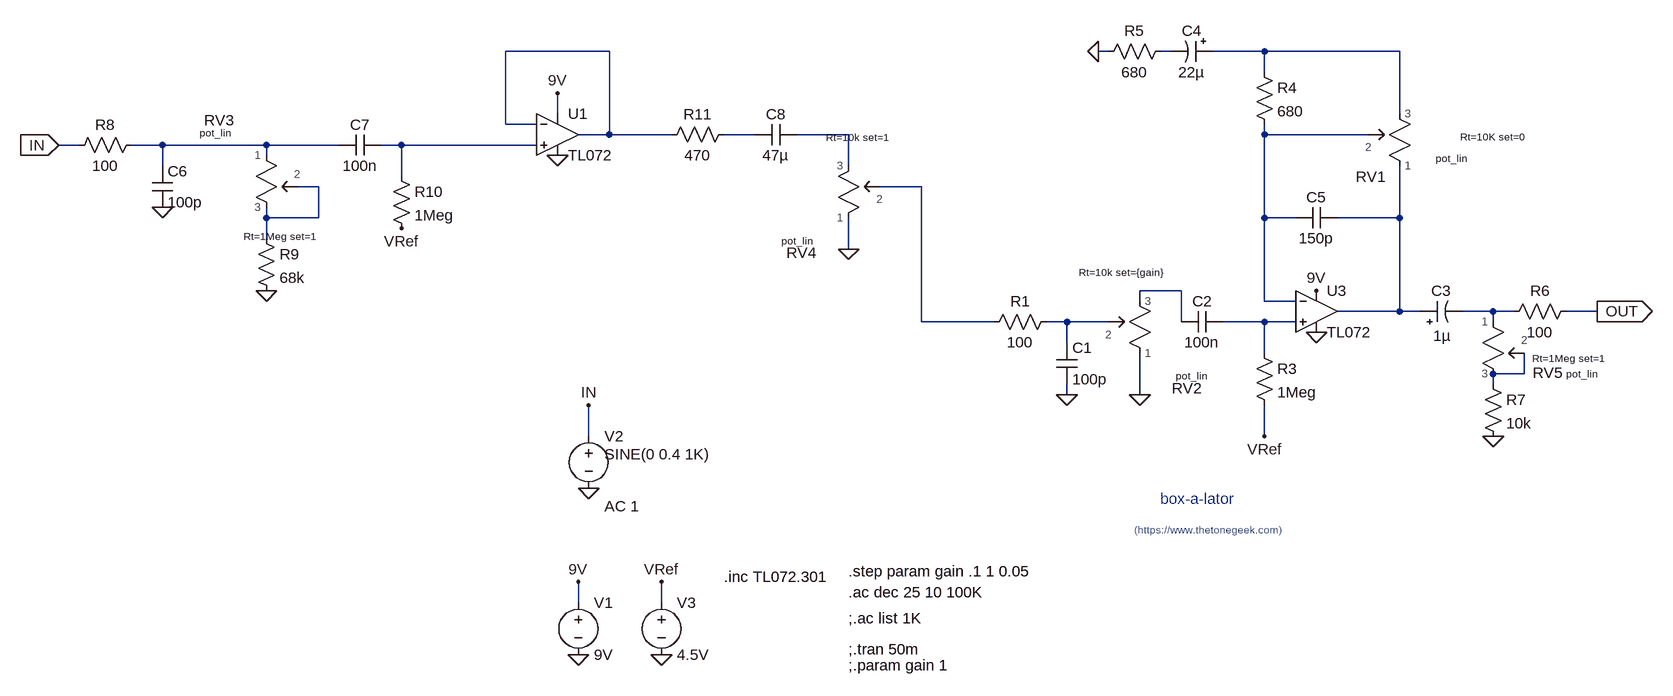
[diagram p0: schematic box-a-lator.asc]
box-a-lator.asc, the LTspice schematic file:
Version 4
SHEET 1 2004 1372
WIRE -1664 48 -1824 48
WIRE -896 48 -912 48
WIRE -800 48 -816 48
WIRE -656 48 -736 48
WIRE -448 48 -656 48
WIRE -656 80 -656 48
WIRE -1744 144 -1744 112
WIRE -448 144 -448 48
WIRE -1824 160 -1824 48
WIRE -1776 160 -1824 160
WIRE -1664 176 -1664 48
WIRE -1664 176 -1712 176
WIRE -1568 176 -1664 176
WIRE -1440 176 -1488 176
WIRE -1296 176 -1376 176
WIRE -656 176 -656 160
WIRE -496 176 -656 176
WIRE -2480 192 -2512 192
WIRE -2352 192 -2400 192
WIRE -2192 192 -2352 192
WIRE -2080 192 -2192 192
WIRE -1984 192 -2016 192
WIRE -1776 192 -1984 192
WIRE -2192 208 -2192 192
WIRE -2352 224 -2352 192
WIRE -1296 224 -1296 176
WIRE -1984 240 -1984 192
WIRE -2112 256 -2144 256
WIRE -1184 256 -1248 256
WIRE -2192 304 -2192 288
WIRE -2112 304 -2112 256
WIRE -2112 304 -2192 304
WIRE -656 304 -656 176
WIRE -608 304 -656 304
WIRE -448 304 -448 224
WIRE -448 304 -544 304
WIRE -2192 336 -2192 304
WIRE -1296 352 -1296 304
WIRE -784 416 -848 416
WIRE -848 432 -848 416
WIRE -656 432 -656 304
WIRE -608 432 -656 432
WIRE -448 448 -448 304
WIRE -448 448 -544 448
WIRE -416 448 -448 448
WIRE -304 448 -352 448
WIRE -272 448 -304 448
WIRE -144 448 -192 448
WIRE -1184 464 -1184 256
WIRE -1072 464 -1184 464
WIRE -960 464 -992 464
WIRE -896 464 -960 464
WIRE -784 464 -784 416
WIRE -656 464 -720 464
WIRE -608 464 -656 464
WIRE -304 464 -304 448
WIRE -960 496 -960 464
WIRE -656 512 -656 464
WIRE -256 544 -256 512
WIRE -256 544 -304 544
WIRE -304 560 -304 544
WIRE -960 576 -960 560
WIRE -848 576 -848 512
WIRE -1696 640 -1696 592
WIRE -656 640 -656 592
WIRE -1712 896 -1712 864
WIRE -1584 896 -1584 864
FLAG -144 448 OUT
IOPIN -144 448 Out
FLAG -2512 192 IN
IOPIN -2512 192 In
FLAG -848 576 0
FLAG -304 640 0
FLAG -912 48 0
FLAG -1712 976 0
FLAG -1712 864 9V
FLAG -576 416 9V
FLAG -576 480 0
FLAG -656 640 VRef
FLAG -1696 720 0
FLAG -960 576 0
FLAG -1584 976 0
FLAG -1584 864 VRef
FLAG -1696 592 IN
FLAG -1744 208 0
FLAG -1744 112 9V
FLAG -1296 352 0
FLAG -2192 416 0
FLAG -2352 288 0
FLAG -1984 320 VRef
SYMBOL OpAmps\\opamp2 -576 384 R0
SYMATTR InstName U3
SYMATTR Value TL072
SYMBOL cap -720 448 R90
WINDOW 0 0 32 VBottom 2
WINDOW 3 32 32 VTop 2
SYMATTR InstName C2
SYMATTR Value 100n
SYMATTR SpiceLine V=35
SYMBOL res -672 496 R0
SYMATTR InstName R3
SYMATTR Value 1Meg
SYMBOL res -912 64 R270
WINDOW 0 32 56 VTop 2
WINDOW 3 0 56 VBottom 2
SYMATTR InstName R5
SYMATTR Value 680
SYMBOL res -672 64 R0
SYMATTR InstName R4
SYMATTR Value 680
SYMBOL res -976 448 R90
WINDOW 0 0 56 VBottom 2
WINDOW 3 32 56 VTop 2
SYMATTR InstName R1
SYMATTR Value 100
SYMBOL cap -544 288 R90
WINDOW 0 0 32 VBottom 2
WINDOW 3 32 32 VTop 2
SYMATTR InstName C5
SYMATTR Value 150p
SYMBOL res -176 432 R90
WINDOW 0 0 56 VBottom 2
WINDOW 3 32 56 VTop 2
SYMATTR InstName R6
SYMATTR Value 100
SYMBOL res -320 544 R0
SYMATTR InstName R7
SYMATTR Value 10k
SYMBOL polcap -736 32 R90
WINDOW 0 0 32 VBottom 2
WINDOW 3 32 32 VTop 2
SYMATTR InstName C4
SYMATTR Value 22µ
SYMBOL polcap -416 464 R270
WINDOW 0 32 32 VTop 2
WINDOW 3 -6 33 VBottom 2
SYMATTR InstName C3
SYMATTR Value 1µ
SYMBOL voltage -1712 880 R0
WINDOW 123 0 0 Left 0
WINDOW 39 0 0 Left 0
SYMATTR InstName V1
SYMATTR Value 9V
SYMBOL voltage -1696 624 R0
WINDOW 123 24 124 Left 2
WINDOW 39 24 152 Left 2
WINDOW 3 24 44 Left 2
SYMATTR Value2 AC 1
SYMATTR Value SINE(0 0.4 1K)
SYMATTR InstName V2
SYMBOL cap -976 496 R0
SYMATTR InstName C1
SYMATTR Value 100p
SYMBOL pot -432 240 R180
WINDOW 0 37 -1 Left 2
WINDOW 3 -176 61 Left 1
WINDOW 38 -87 28 Left 1
SYMATTR InstName RV1
SYMATTR Value Rt=10K set=0
SYMATTR SpiceLine ""
SYMBOL voltage -1584 880 R0
WINDOW 123 0 0 Left 0
WINDOW 39 0 0 Left 0
SYMATTR InstName V3
SYMATTR Value 4.5V
SYMBOL pot -832 528 R180
WINDOW 0 -80 -38 Left 2
WINDOW 3 -19 140 Left 1
WINDOW 38 -87 -19 Left 1
SYMATTR InstName RV2
SYMATTR Value Rt=10k set={gain}
SYMATTR SpiceLine ""
SYMBOL res -2384 176 R90
WINDOW 0 0 56 VBottom 2
WINDOW 3 32 56 VTop 2
SYMATTR InstName R8
SYMATTR Value 100
SYMBOL cap -2368 224 R0
SYMATTR InstName C6
SYMATTR Value 100p
SYMBOL res -2208 320 R0
SYMATTR InstName R9
SYMATTR Value 68k
SYMBOL pot -2208 192 R0
WINDOW 0 -80 -38 Left 2
WINDOW 3 -19 140 Left 1
WINDOW 38 -87 -19 Left 1
SYMATTR InstName RV3
SYMATTR Value Rt=1Meg set=1
SYMATTR SpiceLine ""
SYMBOL cap -2016 176 R90
WINDOW 0 0 32 VBottom 2
WINDOW 3 32 32 VTop 2
SYMATTR InstName C7
SYMATTR Value 100n
SYMATTR SpiceLine V=35
SYMBOL res -2000 224 R0
SYMATTR InstName R10
SYMATTR Value 1Meg
SYMBOL OpAmps\\opamp2 -1744 112 R0
SYMATTR InstName U1
SYMATTR Value TL072
SYMBOL res -1472 160 R90
WINDOW 0 0 56 VBottom 2
WINDOW 3 32 56 VTop 2
SYMATTR InstName R11
SYMATTR Value 470
SYMBOL cap -1376 160 R90
WINDOW 0 0 32 VBottom 2
WINDOW 3 32 32 VTop 2
SYMATTR InstName C8
SYMATTR Value 47µ
SYMATTR SpiceLine V=35
SYMBOL pot -1312 320 M180
WINDOW 0 -80 -38 Left 2
WINDOW 3 -19 140 Left 1
WINDOW 38 -87 -19 Left 1
SYMATTR InstName RV4
SYMATTR Value Rt=10k set=1
SYMATTR SpiceLine ""
SYMBOL pot -320 448 R0
WINDOW 0 77 94 Left 2
WINDOW 3 76 72 Left 1
WINDOW 38 128 96 Left 1
SYMATTR InstName RV5
SYMATTR Value Rt=1Meg set=1
SYMATTR SpiceLine ""
TEXT -1488 856 Left 2 !.inc TL072.301
TEXT -1296 880 Left 2 !.ac dec 25 10 100K
TEXT -1296 848 Left 2 !.step param gain .1 1 0.05
TEXT -816 736 Left 2 ;box-a-lator
TEXT -856 784 Left 1 ;(https://www.thetonegeek.com)
TEXT -1296 920 Left 2 !;.ac list 1K
TEXT -1296 968 Left 2 !;.tran 50m
TEXT -1296 992 Left 2 !;.param gain 1

The netlist it stands for:
* box-a-lator.asc
XU3 N015 N006 9V 0 N011 TL072  ; pins In+ In- V+ V- OUT
C2 N015 N012 100n V=35
R3 N015 VRef 1Meg
R5 0 N002 680
R4 N003 N006 680
R1 N014 N010 100
C5 N011 N006 150p
R6 OUT N013 100
R7 N016 0 10k
C4 N003 N002 22µ
C3 N011 N013 1µ
V1 9V 0 9V
V2 IN 0 SINE(0 0.4 1K) AC 1
C1 N014 0 100p
XRV1 N011 N006 N003 pot_lin Rt=10K set=0  ; pins 1 2 3
V3 VRef 0 4.5V
XRV2 0 N014 N012 pot_lin Rt=10k set={gain}  ; pins 1 2 3
R8 N007 IN 100
C6 N007 0 100p
R9 N009 0 68k
XRV3 N007 N009 N009 pot_lin Rt=1Meg set=1  ; pins 1 2 3
C7 N008 N007 100n V=35
R10 N008 VRef 1Meg
XU1 N008 N001 9V 0 N001 TL072  ; pins In+ In- V+ V- OUT
R11 N004 N001 470
C8 N005 N004 47µ V=35
XRV4 0 N010 N005 pot_lin Rt=10k set=1  ; pins 1 2 3
XRV5 N013 N016 N016 pot_lin Rt=1Meg set=1  ; pins 1 2 3
.inc TL072.301
.ac dec 25 10 100K
.step param gain .1 1 0.05
* box-a-lator
* (https://www.thetonegeek.com)
;.ac list 1K
;.tran 50m
;.param gain 1
.lib pot.lib
.backanno
.end